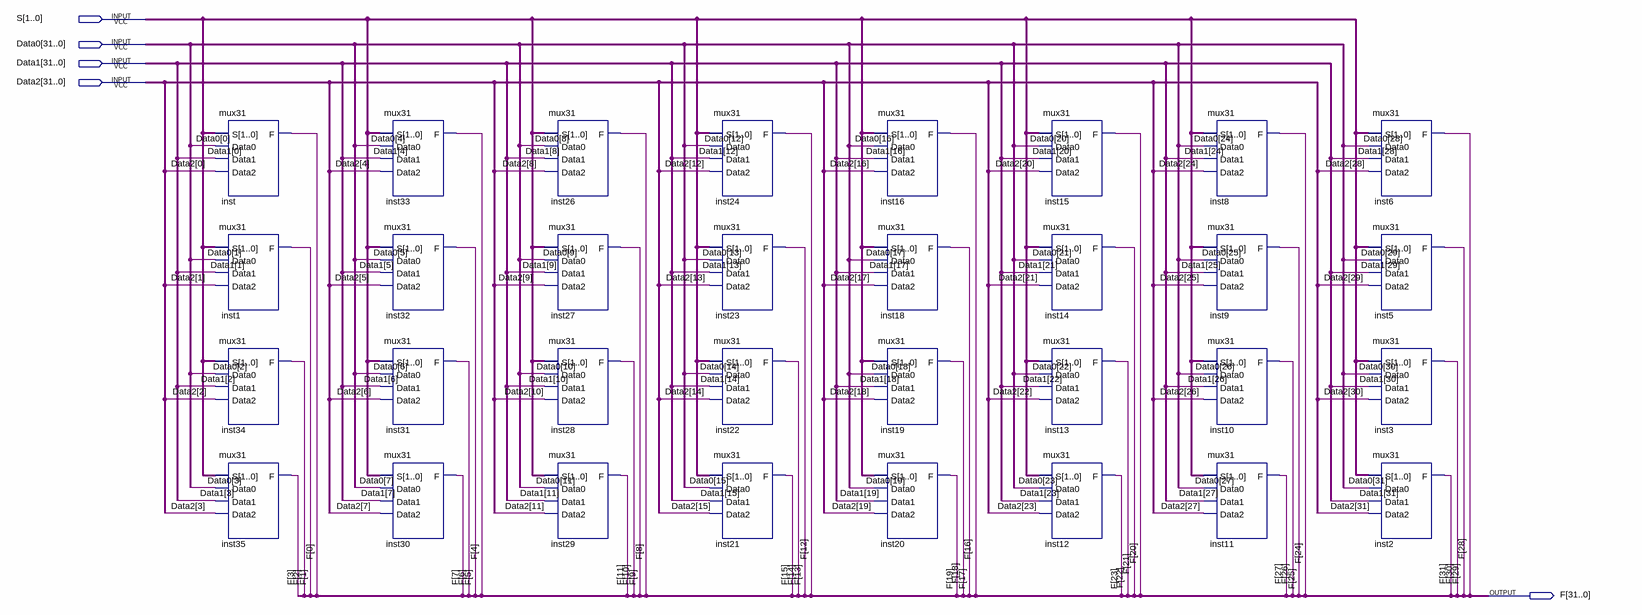
[diagram p0: schematic sheet]
// Quartus schematic mux31_32.bdf as structural Verilog: 32 symbols, 5 pins
module mux31_32 (
  input  [1:0] S,
  input  [31:0] Data0,
  input  [31:0] Data1,
  input  [31:0] Data2,
  output [31:0] F
);

  mux31 inst (.S(S), .Data0(Data0[0]), .Data1(Data1[0]), .Data2(Data2[0]), .F(F[0]));
  mux31 inst1 (.S(S), .Data0(Data0[1]), .Data1(Data1[1]), .Data2(Data2[1]), .F(F[1]));
  mux31 inst34 (.S(S), .Data0(Data0[2]), .Data1(Data1[2]), .Data2(Data2[2]), .F(F[2]));
  mux31 inst35 (.S(S), .Data0(Data0[3]), .Data1(Data1[3]), .Data2(Data2[3]), .F(F[3]));
  mux31 inst33 (.S(S), .Data0(Data0[4]), .Data1(Data1[4]), .Data2(Data2[4]), .F(F[4]));
  mux31 inst32 (.S(S), .Data0(Data0[5]), .Data1(Data1[5]), .Data2(Data2[5]), .F(F[5]));
  mux31 inst31 (.S(S), .Data0(Data0[6]), .Data1(Data1[6]), .Data2(Data2[6]), .F(F[6]));
  mux31 inst30 (.S(S), .Data0(Data0[7]), .Data1(Data1[7]), .Data2(Data2[7]), .F(F[7]));
  mux31 inst26 (.S(S), .Data0(Data0[8]), .Data1(Data1[8]), .Data2(Data2[8]), .F(F[8]));
  mux31 inst27 (.S(S), .Data0(Data0[9]), .Data1(Data1[9]), .Data2(Data2[9]), .F(F[9]));
  mux31 inst28 (.S(S), .Data0(Data0[10]), .Data1(Data1[10]), .Data2(Data2[10]), .F(F[10]));
  mux31 inst29 (.S(S), .Data0(Data0[11]), .Data1(Data1[11]), .Data2(Data2[11]), .F(F[11]));
  mux31 inst24 (.S(S), .Data0(Data0[12]), .Data1(Data1[12]), .Data2(Data2[12]), .F(F[12]));
  mux31 inst23 (.S(S), .Data0(Data0[13]), .Data1(Data1[13]), .Data2(Data2[13]), .F(F[13]));
  mux31 inst22 (.S(S), .Data0(Data0[14]), .Data1(Data1[14]), .Data2(Data2[14]), .F(F[14]));
  mux31 inst21 (.S(S), .Data0(Data0[15]), .Data1(Data1[15]), .Data2(Data2[15]), .F(F[15]));
  mux31 inst16 (.S(S), .Data0(Data0[16]), .Data1(Data1[16]), .Data2(Data2[16]), .F(F[16]));
  mux31 inst18 (.S(S), .Data0(Data0[17]), .Data1(Data1[17]), .Data2(Data2[17]), .F(F[17]));
  mux31 inst19 (.S(S), .Data0(Data0[18]), .Data1(Data1[18]), .Data2(Data2[18]), .F(F[18]));
  mux31 inst20 (.S(S), .Data0(Data0[19]), .Data1(Data1[19]), .Data2(Data2[19]), .F(F[19]));
  mux31 inst15 (.S(S), .Data0(Data0[20]), .Data1(Data1[20]), .Data2(Data2[20]), .F(F[20]));
  mux31 inst14 (.S(S), .Data0(Data0[21]), .Data1(Data1[21]), .Data2(Data2[21]), .F(F[21]));
  mux31 inst13 (.S(S), .Data0(Data0[22]), .Data1(Data1[22]), .Data2(Data2[22]), .F(F[22]));
  mux31 inst12 (.S(S), .Data0(Data0[23]), .Data1(Data1[23]), .Data2(Data2[23]), .F(F[23]));
  mux31 inst8 (.S(S), .Data0(Data0[24]), .Data1(Data1[24]), .Data2(Data2[24]), .F(F[24]));
  mux31 inst9 (.S(S), .Data0(Data0[25]), .Data1(Data1[25]), .Data2(Data2[25]), .F(F[25]));
  mux31 inst10 (.S(S), .Data0(Data0[26]), .Data1(Data1[26]), .Data2(Data2[26]), .F(F[26]));
  mux31 inst11 (.S(S), .Data0(Data0[27]), .Data1(Data1[27]), .Data2(Data2[27]), .F(F[27]));
  mux31 inst6 (.S(S), .Data0(Data0[28]), .Data1(Data1[28]), .Data2(Data2[28]), .F(F[28]));
  mux31 inst5 (.S(S), .Data0(Data0[29]), .Data1(Data1[29]), .Data2(Data2[29]), .F(F[29]));
  mux31 inst3 (.S(S), .Data0(Data0[30]), .Data1(Data1[30]), .Data2(Data2[30]), .F(F[30]));
  mux31 inst2 (.S(S), .Data0(Data0[31]), .Data1(Data1[31]), .Data2(Data2[31]), .F(F[31]));
endmodule
